# EAGLE design ADXL335 (EAGLE 6.5.0)
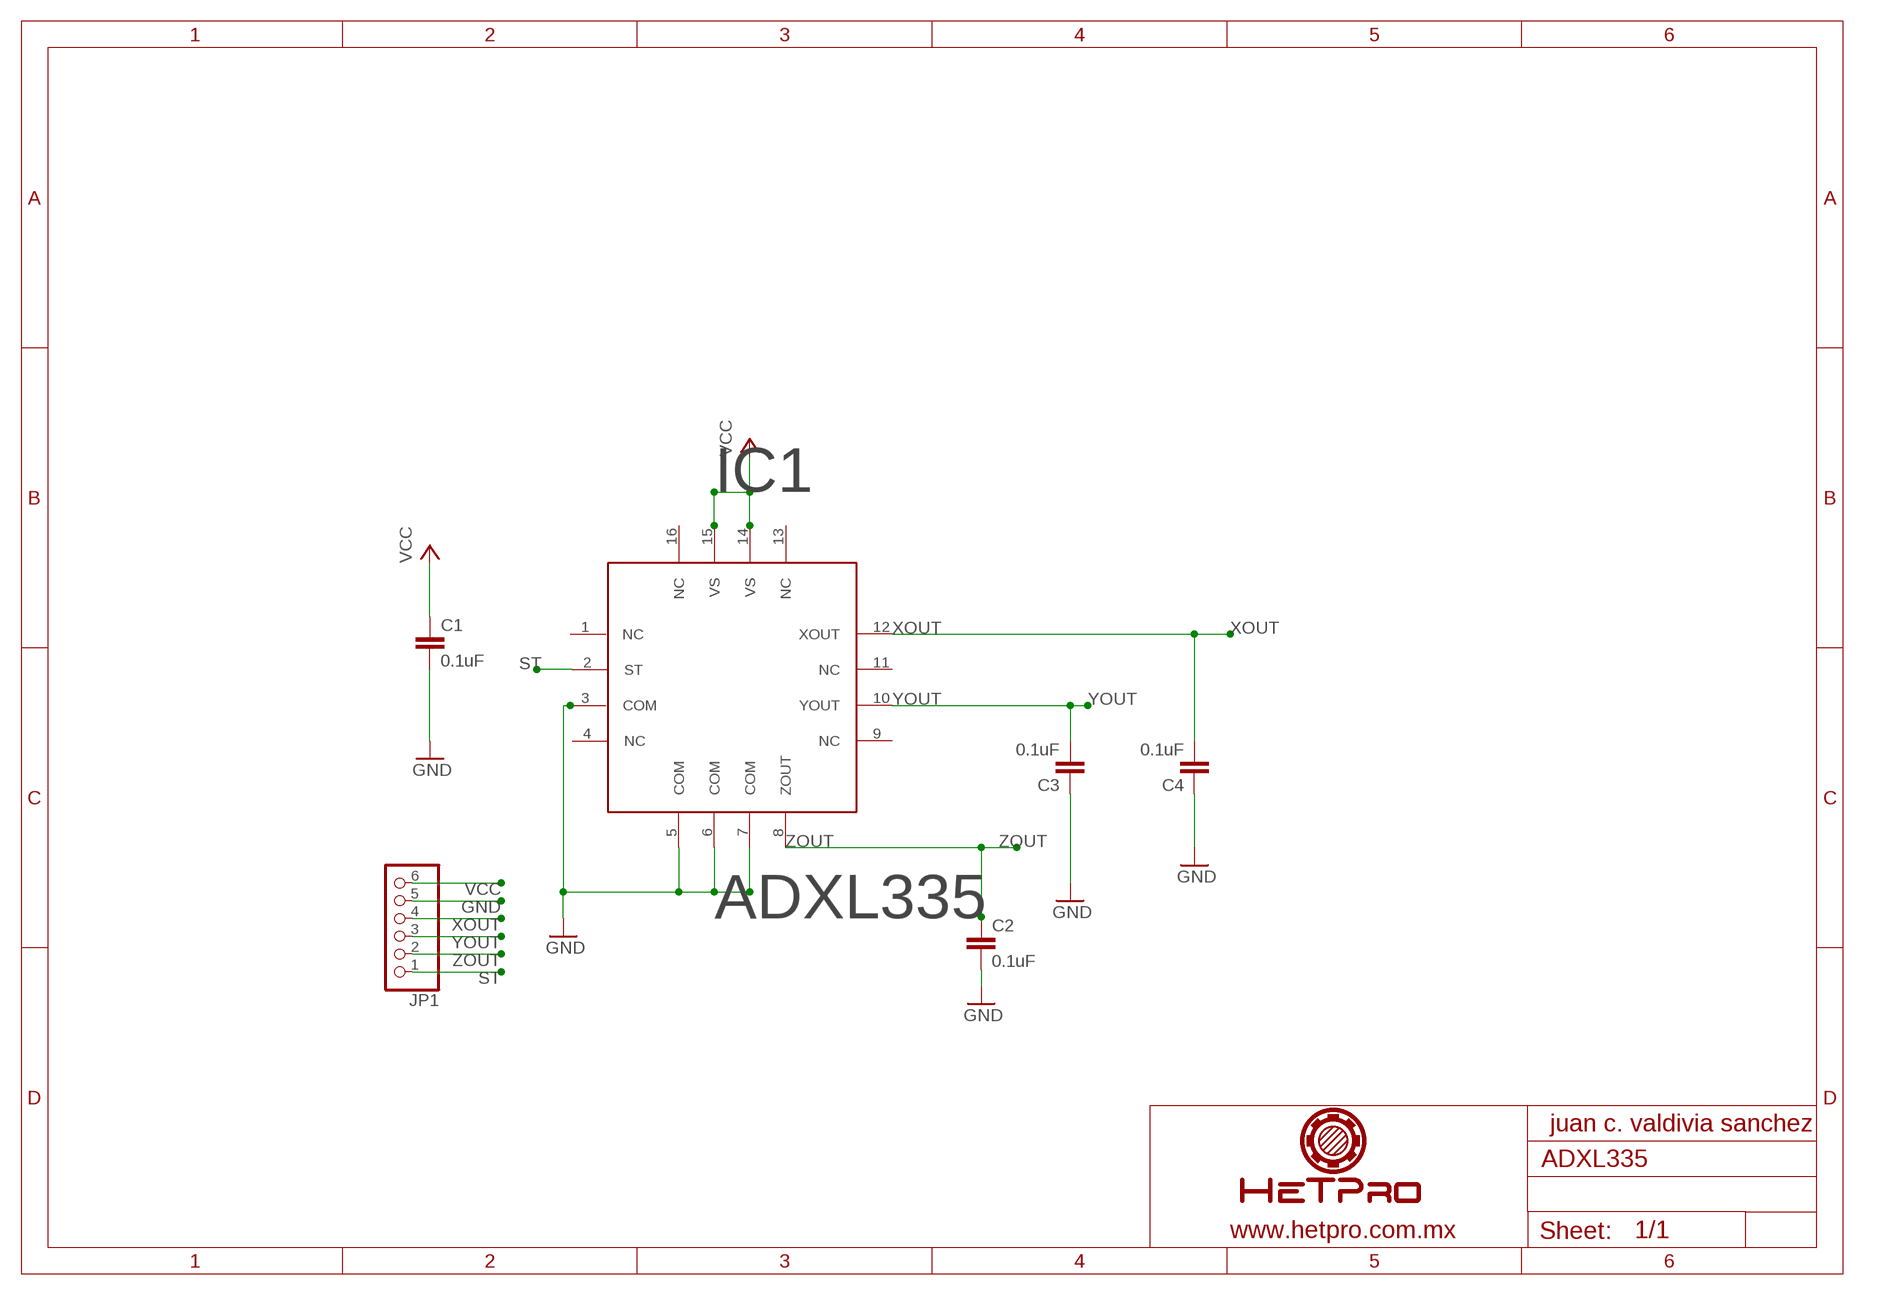
[diagram p0: schematic, sheet 1]

## Parts
C1  0.1uF  C-EUC0603  [C0603]
C2  0.1uF  C-EUC0603  [C0603]
C3  0.1uF  C-EUC0603  [C0603]
C4  0.1uF  C-EUC0603  [C0603]
IC1  ADXL335  [ADXL335]
JP1  PINHD-1X6  [1X06]

## Nets
GND: C1.2 C2.2 C3.1 C4.1 IC1.3(COM) IC1.5(COM) IC1.6(COM) IC1.7(COM) JP1.5
ST: IC1.2(ST) JP1.1
VCC: C1.1 IC1.14(VS) IC1.15(VS) JP1.6
XOUT: C4.2 IC1.12(XOUT) JP1.4
YOUT: C3.2 IC1.10(YOUT) JP1.3
ZOUT: C2.1 IC1.8(ZOUT) JP1.2
Unconnected: IC1.1(NC) IC1.4(NC) IC1.9(NC) IC1.11(NC) IC1.13(NC) IC1.16(NC)

## Notes on the sheet
- juan c. valdivia sanchez
- www.hetpro.com.mx

## Library data of the parts
C1-C4 = resistor:C-EU: CAPACITOR, European symbol
IC1 = ADXL335:ADXL335
JP1 = pinhead:PINHD-1X6: PIN HEADER

## Board
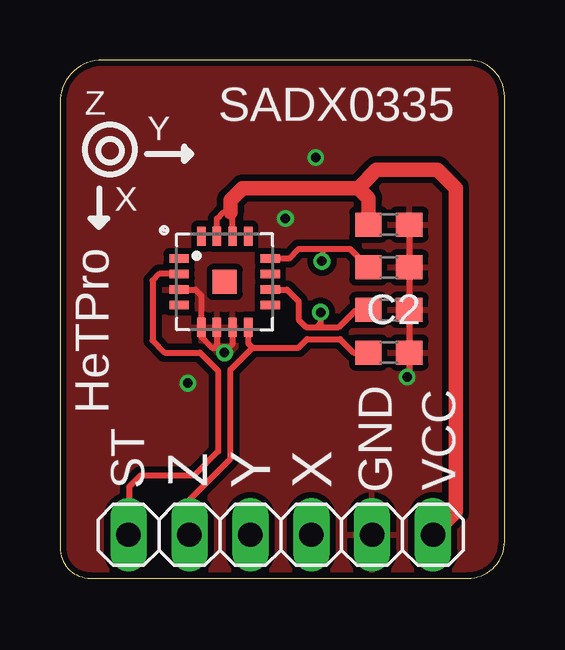
[diagram p1: board, top side]
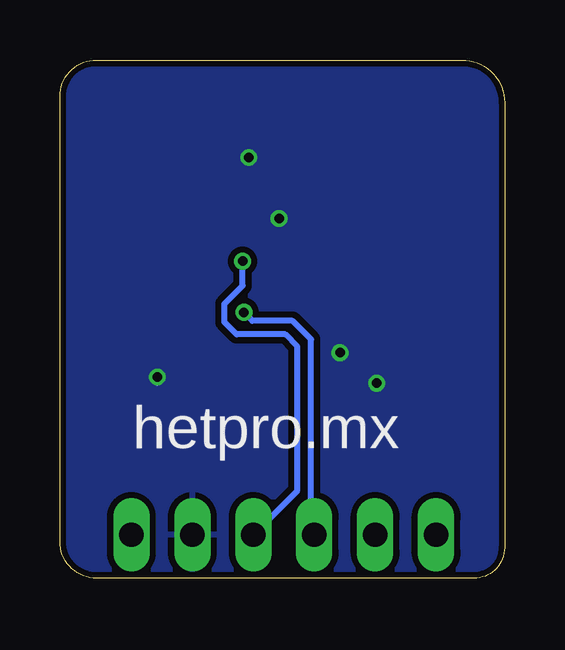
[diagram p2: board, bottom side, seen from below]

Size 18.54 x 21.59 mm. Coordinates in mm from the lower left corner, seen from the top.
Outline: 18.54,1.52 18.54,20.07 arc90 17.02,21.59 1.78,21.59 arc90 0,19.81 0,1.27 arc90 1.27,0 17.02,0 arc90 18.54,1.52
Copper layers (1*16): Top 0.035mm / dielectric 1.5mm / Bottom 0.035mm
Design rules "DRC_HeTPpro_08_2014": minimum track width 8mil, minimum drill 12mil, track to track 8mil, track to pad 8mil, pad to pad 8mil, via to via 8mil, smd to smd 0mil, copper to edge 10mil, drill to drill 10mil, minimum pad ring 10mil, minimum via ring 6mil, stop-mask expansion 2mil, vias tented up to drill 100mil, thermal gap 10mil

### Footprints (pad centres in the part's own frame; a part is rotated, then mirrored left to right if it is on the bottom)
C0603 = smd 1.1 x 1: 1 -0.85,0; 2 0.85,0
ADXL335 = smd 0.8 x 0.35: 1 -1.9,0.975; 2 -1.9,0.325; 3 -1.9,-0.325; 4 -1.9,-0.975; 9 1.9,-0.975; 10 1.9,-0.325; 11 1.9,0.325; 12 1.9,0.975 | smd 0.35 x 0.8: 5 -0.975,-1.9; 6 -0.325,-1.9; 7 0.325,-1.9; 8 0.975,-1.9; 13 0.975,1.9; 14 0.325,1.9; 15 -0.325,1.9; 16 -0.975,1.9 | smd 1 x 1: P$1 0,0
1X06 = drill 1.016 long: 1 -6.35,0; 2 -3.81,0; 3 -1.27,0; 4 1.27,0; 5 3.81,0; 6 6.35,0

### Placement (x,y rotation side)
C1  13.72,14.73 0 top
C2  13.72,9.4 0 top
C3  13.72,11.18 180 top
C4  13.72,12.95 180 top
IC1  6.87,12.35 0 top
JP1  9.21,1.81 0 top

### Tracks (layer width: path | path; a pad name or v marks a point on that pad's centre or on a via)
GND  (via drill 0.4)
  Top 0.254: IC1.7 7.2,9.74 v6.86,9.4 | v6.86,9.4 6.66,9.6 6.35,9.6 5.9,10.05 IC1.5 5.89,11.79 5.66,12.02 IC1.3 | IC1.6 6.55,9.71 v6.86,9.4 | C1.2 C4.1 C3.1 C2.2 14.57,8.47 v14.48,8.38
  Bottom 0.254: v6.86,9.4 6.86,9.14 | v14.48,8.38 14.48,8.13
  other vias: 10.67,17.53 9.4,14.99 5.33,8.13
  pour Top (isolate 0.254): 0,21.59 18.54,21.59 18.54,0 0,0
  pour Bottom (isolate 0.254): 0,0 18.54,0 18.54,21.59 0,21.59
ST
  Top 0.254: 2.85,1.82 JP1.1 2.9,1.84 2.9,3.81 3.35,4.27 5.59,4.27 6.6,5.28 6.6,8.64 5.84,9.4 4.37,9.4 3.86,9.91 3.86,12.4 4.14,12.67 IC1.2
VCC
  Top 0.254: 15.63,1.88 JP1.6 | IC1.15 6.55,14.98 6.81,15.24 7.11,15.24 7.2,15.15 IC1.14
  Top 0.61: 15.63,1.88 16.51,2.76 16.51,16.26 15.75,17.02 13.21,17.02 12.45,16.26 | 12.45,16.26 7.62,16.26 7.11,15.75 7.11,15.24 | C1.1 12.87,15.84 12.45,16.26
XOUT  (via drill 0.4)
  Top 0.254: IC1.12 9.56,13.32 9.96,13.72 10.97,13.72 | 10.97,13.72 12.1,13.72 C4.2 | v10.92,13.21 10.97,13.26 10.97,13.72
  Bottom 0.254: v10.92,13.21 10.92,12.19 11.68,11.43 11.68,10.67 11.18,10.16 9.14,10.16 8.64,9.65 8.64,3.65 JP1.4
YOUT  (via drill 0.4)
  Top 0.254: IC1.10 9.46,12.02 9.96,11.53 9.96,10.77 10.26,10.46 10.72,10.46 | 10.72,10.46 11.63,10.46 12.29,11.13 12.81,11.13 C3.2 | v10.87,11.07 10.87,10.62 10.72,10.46
  Bottom 0.254: v10.87,11.07 10.52,10.72 8.84,10.72 8.07,9.95 8.07,1.94 JP1.3
ZOUT
  Top 0.254: IC1.8 7.85,9.78 8.03,9.6 | 8.03,9.6 9.96,9.6 10.31,9.96 11.68,9.96 12.24,9.4 C2.1 | JP1.2 5.4,3.27 7.11,4.98 7.11,8.69 8.03,9.6

### Text on the board
tPlace: Z | SADX0335 | Y | X | HeTPro
tNames: ST | Z | Y | X | GND | VCC
bNames: hetpro.mx